# EAGLE design lighthouse (EAGLE 6.5.0)
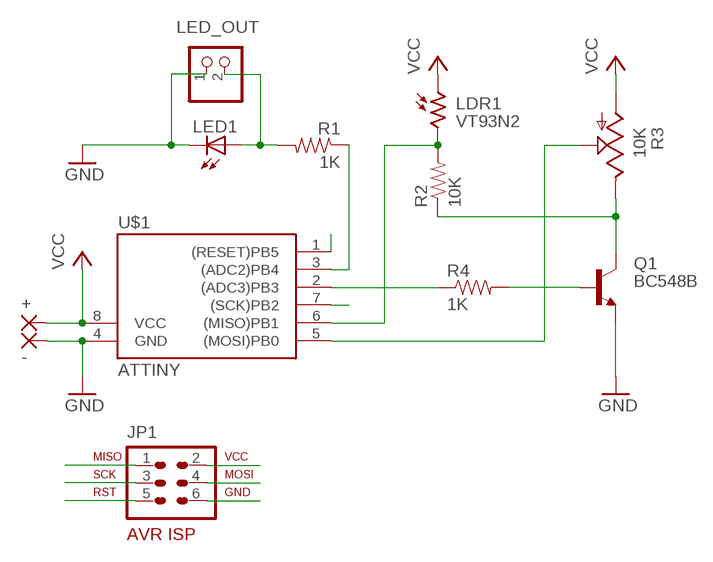
[diagram p0: schematic, sheet 1]

## Parts
+  PAD-TERMINAL  [2,54/1,1]
-  PAD-TERMINAL  [2,54/1,1]
JP1  AVR-ISP-6VERT  [AVR-ISP-6]
LDR1  VT93N2  [VT900]
LED1  LED-3MM-NO_SILK  [LED3MM-NS]
LED_OUT  PINHD-1X2  [1X02]
Q1  BC548B  [TO92-EBC]
R1  1K  RESISTORPTH-1/4W  [AXIAL-0.4]
R2  10K  RESISTORPTH-1/4W  [AXIAL-0.4]
R3  10K  TRIM_US-CA6H  [CA6H]
R4  1K  RESISTORPTH-1/4W  [AXIAL-0.4]
U$1  ATTINY  TINY138P3  [DIL08]

## Nets
GND: -.1(P) JP1.6 LED1.K(C) LED_OUT.1 Q1.E U$1.4(GND)
MISO: JP1.1 LDR1.2 R2.P$2 U$1.6((MISO)PB1)
MOSI: JP1.4 R3.S U$1.5((MOSI)PB0)
N$2: Q1.B R4.P$2
N$3: Q1.C R2.P$1 R3.E
N$4: R4.P$1 U$1.2((ADC3)PB3)
N$5: R1.P$1 U$1.3((ADC2)PB4)
N$6: LED1.A LED_OUT.2 R1.P$2
RST: JP1.5 U$1.1((RESET)PB5)
SCK: JP1.3 U$1.7((SCK)PB2)
VCC: +.1(P) JP1.2 LDR1.1 R3.A U$1.8(VCC)

## Library data of the parts
+ - = ee2parts:PAD-TERMINAL: LARGE THROUGH-HOLE PAD Large pad for mounting PCB pin for convenient prototype off-board connections; OC_NEWARK: unknown
JP1 = avr-7:AVR-ISP-6: AVR ISP-6 Serial Programming Header
LDR1 = photo-elements:VT9: Photoconductive Cell VT900 Series Source: http://optoelectronics.perkinelmer.com/content/Datasheets/DTS_vt900seriesdatasheet.pdf; OC_NEWARK: unknown
LED1 = SparkFun-LED:LED: LEDs Standard schematic elements and footprints for 5mm, 3mm, 1206, and 0603 sized LEDs. 5mm - Spark Fun Electronics SKU : COM-00529 (and others); OC_NEWARK: unknown
LED_OUT = pinhead:PINHD-1X2: PIN HEADER; MPN: BC237B; OC_NEWARK: 08N7616
Q1 = transistor-npn:BC548*: NPN Transistor; OC_NEWARK: unknown
R1 R2 R4 = SparkFun-Passives:RESISTOR: Resistor Basic schematic elements and footprints for 0603, 1206, and PTH resistors.; OC_NEWARK: unknown
R3 = pot:TRIM_US-: POTENTIOMETER; OC_NEWARK: unknown
U$1 = avr-7:TINY13*; OC_NEWARK: unknown

## Board
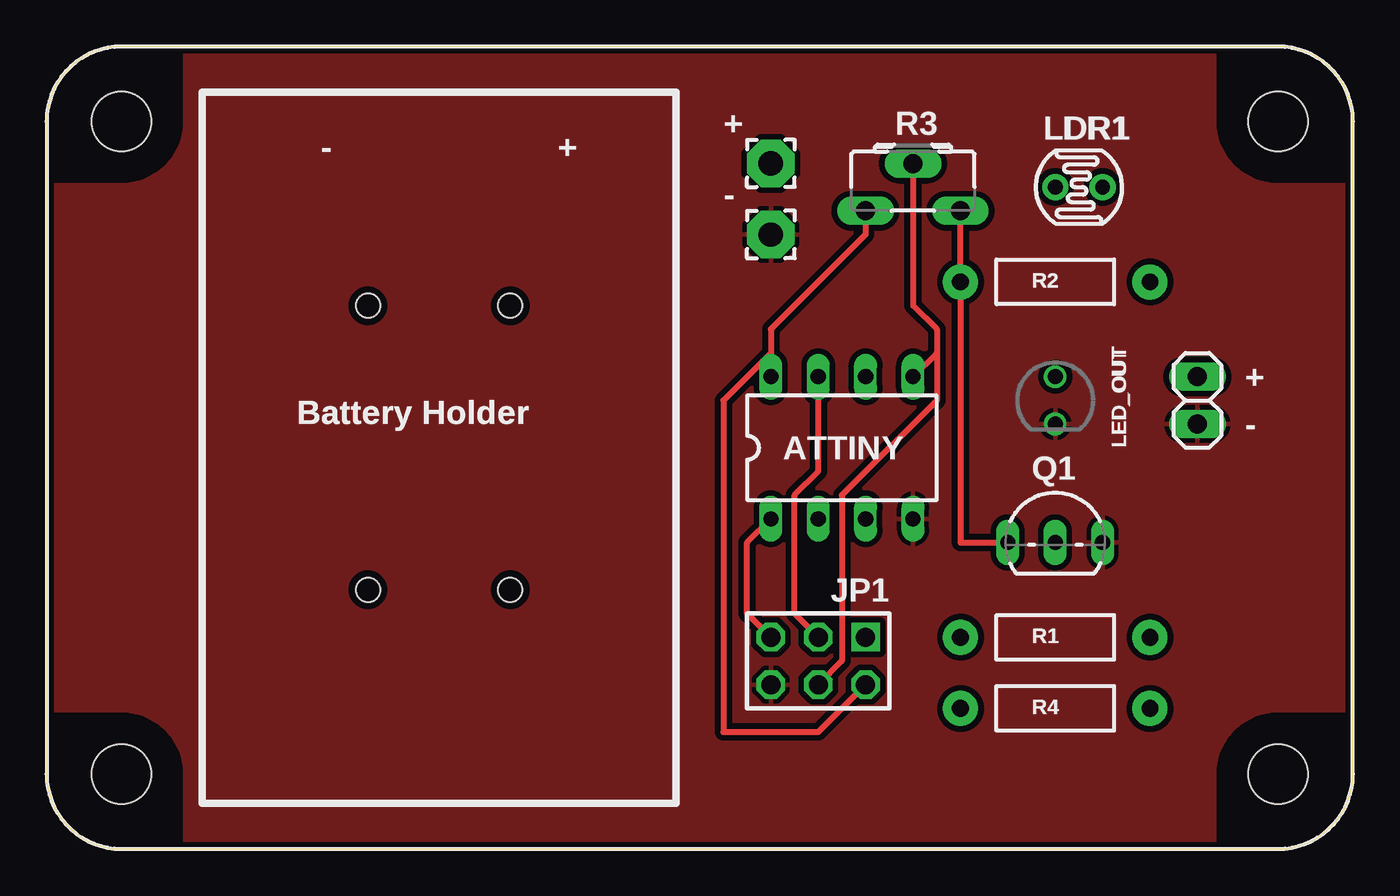
[diagram p1: board, top side]
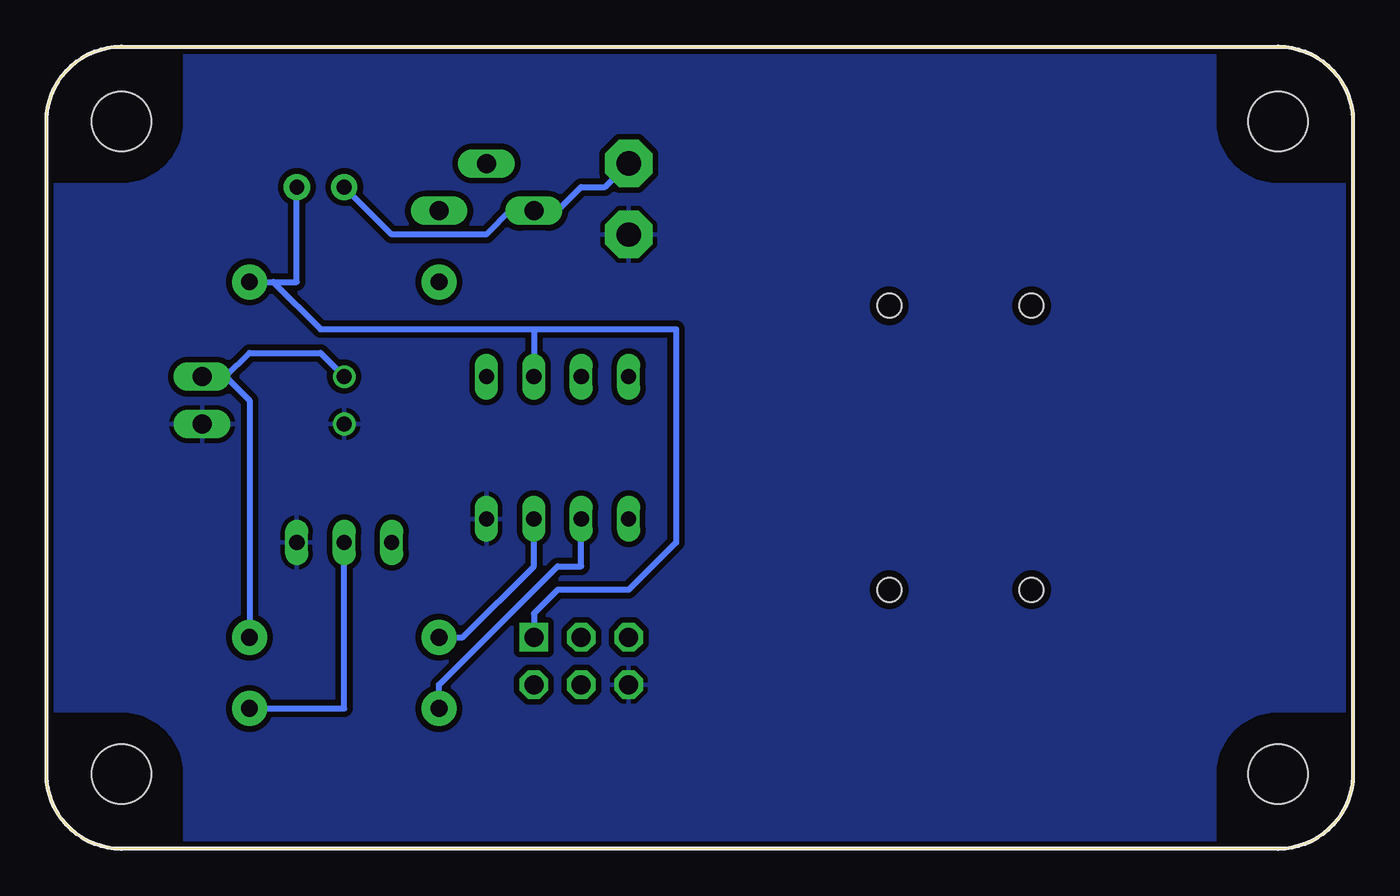
[diagram p2: board, bottom side, seen from below]

Size 70 x 43 mm. Coordinates in mm from the lower left corner, seen from the top.
Copper layers (1*16): Top 0.0356mm / dielectric 1.5011mm / Bottom 0.0356mm
Design rules "LaenPCBOrder": minimum track width 6mil, minimum drill 13mil, track to track 6mil, track to pad 6mil, pad to pad 6mil, via to via 6mil, smd to smd 6mil, copper to edge 15mil, drill to drill 6mil, minimum pad ring 7mil, minimum via ring 7mil, stop-mask expansion 4mil, vias tented up to drill 0mil, thermal gap 10mil
Holes 1.3 mm at 24.84,13.88 17.22,29.12 24.84,29.12 17.22,13.88

### Footprints (pad centres in the part's own frame; a part is rotated, then mirrored left to right if it is on the bottom)
2,54/1,1 = drill 1.3 pad 2.54 octagon: 1 0,0
AVR-ISP-6 = drill 1.016 square: 1 -2.54,-1.27 | drill 1.016 octagon: 2 -2.54,1.27; 3 0,-1.27; 4 0,1.27; 5 2.54,-1.27; 6 2.54,1.27
VT900 = drill 0.8 pad 1.4: 1 -1.27,0; 2 1.27,0
LED3MM-NS = drill 0.813: A -1.27,0; K 1.27,0
1X02 = drill 1.016 long: 1 -1.27,0; 2 1.27,0
TO92-EBC = drill 0.813 long: B 0,-1.27; C -2.54,-1.27; E 2.54,-1.27
AXIAL-0.4 = drill 0.9 pad 1.88: P$1 -5.08,0; P$2 5.08,0
CA6H = drill 1.016 long: A -2.54,0; E 2.54,0; S 0,2.54
DIL08 = drill 0.813 long: 1 -3.81,-3.81; 2 -1.27,-3.81; 3 1.27,-3.81; 4 3.81,-3.81; 5 3.81,3.81; 6 1.27,3.81; 7 -1.27,3.81; 8 -3.81,3.81
DP7043_V1 = hole 3.2: -31,-17.5; 31,-17.5; 31,17.5; -31,17.5

### Placement (x,y rotation side)
+  38.81,36.74 0 top
-  38.81,32.93 0 top
JP1  41.35,10.07 180 top
LDR1  55.32,35.47 0 top
LED1  54.05,24.04 270 top
LED_OUT  61.67,24.04 90 top
Q1  54.05,17.69 0 top
R1  54.05,11.34 0 top
R2  54.05,30.39 0 top
R3  46.43,34.2 0 top
R4  54.05,7.53 0 top
U$1  42.62,21.5 0 top
U$2  [DP7043_V1]  35,21.5 0 top

### Tracks (layer width: path | path; a pad name or v marks a point on that pad's centre or on a via)
GND
  pour Bottom (isolate 0.305): -0.56,43.09 70.56,43.09 70.56,-0.09 -0.56,-0.09
  pour Top (isolate 0.305): -0.56,43.09 70.56,43.09 70.56,-0.09 -0.56,-0.09
MISO
  Bottom 0.33: 43.89,27.85 U$1.6 | 43.89,27.85 55.32,27.85 57.86,30.39 | R2.P$2 57.86,30.39 | LDR1.2 56.59,30.39 57.86,30.39 | JP1.1 43.89,12.61 42.62,13.88 38.81,13.88 36.27,16.42 36.27,27.85 43.89,27.85
MOSI
  Top 0.33: 47.7,26.58 U$1.5 | 47.7,26.58 47.7,27.85 46.43,29.12 R3.S | JP1.4 42.62,10.07 42.62,18.96 47.7,24.04 47.7,26.58
N$2
  Bottom 0.33: Q1.B 54.05,7.53 R4.P$2
N$3
  Top 0.33: Q1.C 48.97,16.42 R2.P$1 R3.E
N$4
  Bottom 0.33: U$1.2 41.35,15.15 42.62,15.15 48.97,8.8 R4.P$1
N$5
  Bottom 0.33: U$1.3 43.89,15.15 47.7,11.34 R1.P$1
N$6
  Bottom 0.33: LED1.A 55.32,26.58 59.13,26.58 60.4,25.31 | R1.P$2 59.13,24.04 60.4,25.31 | 60.4,25.31 LED_OUT.2
RST
  Top 0.33: U$1.1 37.54,16.42 37.54,12.61 JP1.5
SCK
  Top 0.33: U$1.7 41.35,20.23 40.08,18.96 40.08,12.61 JP1.3
VCC
  Top 0.33: 38.81,26.58 38.81,27.85 43.89,32.93 R3.A | 38.81,26.58 U$1.8 | JP1.2 41.35,6.26 36.27,6.26 36.27,24.04 38.81,26.58
  Bottom 0.33: LDR1.1 51.51,32.93 46.43,32.93 45.16,34.2 R3.A 42.62,34.2 41.35,35.47 40.08,35.47 +.1

### Text on the board
tNames: - | + | + | Battery Holder | Battery Holder | -
_tsilk: + | R3 | LDR1 | - | + | - | R2 | + | Battery Holder | Battery Holder | - | LED_OUT | ATTINY | Q1 | JP1 | R1 | R4